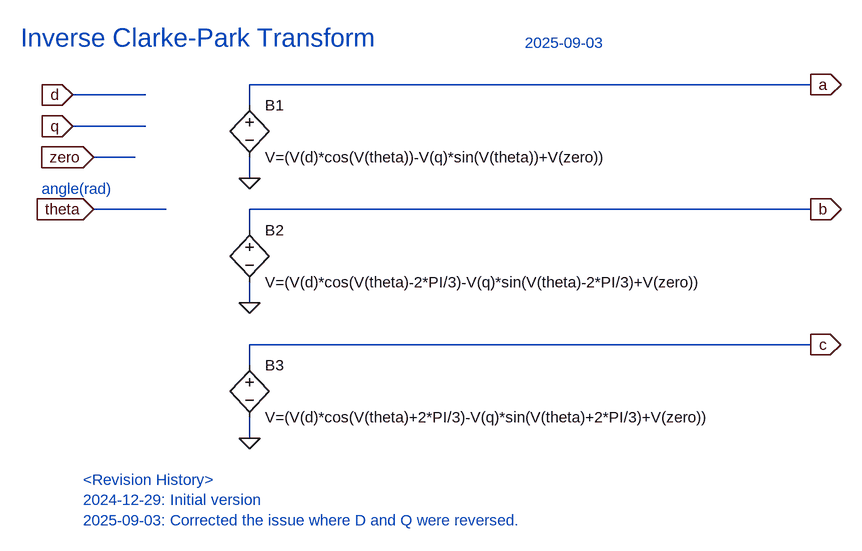
[diagram p0: schematic CLARKE_PARKinv.asc]
CLARKE_PARKinv.asc, the LTspice schematic file:
Version 4.1
SHEET 1 1416 808
WIRE 1264 128 400 128
WIRE 240 144 128 144
WIRE 400 160 400 128
WIRE 240 192 128 192
WIRE 224 240 160 240
WIRE 400 272 400 240
WIRE 272 320 160 320
WIRE 1264 320 400 320
WIRE 400 352 400 320
WIRE 400 464 400 432
WIRE 1264 528 400 528
WIRE 400 560 400 528
WIRE 400 672 400 640
FLAG 128 144 d
IOPIN 128 144 In
FLAG 128 192 q
IOPIN 128 192 In
FLAG 1264 128 a
IOPIN 1264 128 Out
FLAG 400 272 0
FLAG 160 240 zero
IOPIN 160 240 In
FLAG 160 320 theta
IOPIN 160 320 In
FLAG 1264 320 b
IOPIN 1264 320 Out
FLAG 400 464 0
FLAG 1264 528 c
IOPIN 1264 528 Out
FLAG 400 672 0
SYMBOL bv 400 144 R0
SYMATTR InstName B1
SYMATTR Value V=(V(d)*cos(V(theta))-V(q)*sin(V(theta))+V(zero))
SYMBOL bv 400 336 R0
SYMATTR InstName B2
SYMATTR Value V=(V(d)*cos(V(theta)-2*PI/3)-V(q)*sin(V(theta)-2*PI/3)+V(zero))
SYMBOL bv 400 544 R0
SYMATTR InstName B3
SYMATTR Value V=(V(d)*cos(V(theta)+2*PI/3)-V(q)*sin(V(theta)+2*PI/3)+V(zero))
TEXT 48 56 Left 4 ;Inverse Clarke-Park Transform
TEXT 824 64 Left 2 ;2025-09-03
TEXT 80 288 Left 2 ;angle(rad)
TEXT 144 736 Left 2 ;<Revision History>\n2024-12-29: Initial version\n2025-09-03: Corrected the issue where D and Q were reversed.

The netlist it stands for:
* CLARKE_PARKinv.asc
B1 a 0 V=(V(d)*cos(V(theta))-V(q)*sin(V(theta))+V(zero))
B2 b 0 V=(V(d)*cos(V(theta)-2*PI/3)-V(q)*sin(V(theta)-2*PI/3)+V(zero))
B3 c 0 V=(V(d)*cos(V(theta)+2*PI/3)-V(q)*sin(V(theta)+2*PI/3)+V(zero))
* Inverse Clarke-Park Transform
* 2025-09-03
* angle(rad)
* <Revision History>
* 2024-12-29: Initial version
* 2025-09-03: Corrected the issue where D and Q were reversed.
.backanno
.end